# Altium schematic sheet Connectors.SchDoc: 12V Buck Converter Headers
size A4; Organization: University of Guelph; Address1: 50 Stone Rd. E.; Address2: Guelph Ontario; Address3: N1G 2M7; DocumentNumber: 1; Revision: 0.1; SheetNumber: 1; SheetTotal: 1
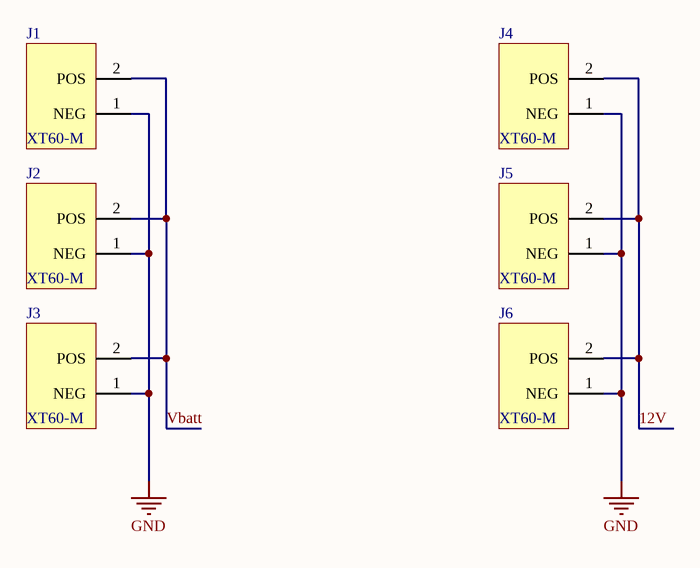
[diagram p0: Connectors.SchDoc]

## Parts
J1  XT60-M  [*AMASS_XT60-M]
J2  XT60-M  [*AMASS_XT60-M]
J3  XT60-M  [*AMASS_XT60-M]
J4  XT60-M  [*AMASS_XT60-M]
J5  XT60-M  [*AMASS_XT60-M]
J6  XT60-M  [*AMASS_XT60-M]

## Nets
GND: J1.1(NEG) J2.1(NEG) J3.1(NEG) J4.1(NEG) J5.1(NEG) J6.1(NEG)
12V: J4.2(POS) J5.2(POS) J6.2(POS)
Vbatt: J1.2(POS) J2.2(POS) J3.2(POS)

## Notes on the sheet
- Title
- Size:
- Date:
- A4
- Number:
- Time:
- Revision:
- Sheet
- of
- File:

## Library data of the parts
J1-J6 = XT60-M: Plug; DC supply; XT60; male; PIN: 2; for cable; soldered; 30A; 500V; MF: AMASS; Availability: Unavailable; Package: Package Analog Devices; MP: XT60-M; Price: None; SnapEDA_Link: https://www.snapeda.com/parts/XT60-M/AMASS/view-part/2883912/?ref=snap; Value: *